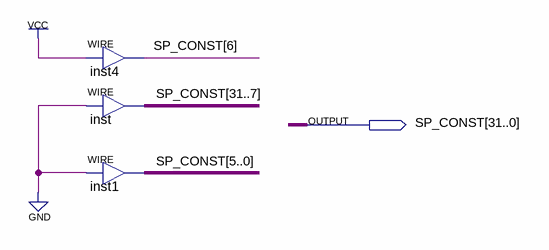
[diagram p0: schematic sheet]
// Quartus schematic SP_const.bdf as structural Verilog: 3 symbols, 1 pins
module SP_const (
  output [31:0] SP_CONST
);

  assign SP_CONST[6] = 1'b1;  // WIRE inst4
  assign SP_CONST[31:7] = {25{1'b0}};  // WIRE inst
  assign SP_CONST[5:0] = {6{1'b0}};  // WIRE inst1
endmodule
